# Altium schematic sheet altuamSTM32_schematic.SchDoc
size A3; DrawnBy: Mohamed Sayed; Engineer: Mohamed Sayed; SheetNumber: 1; SheetTotal: 1
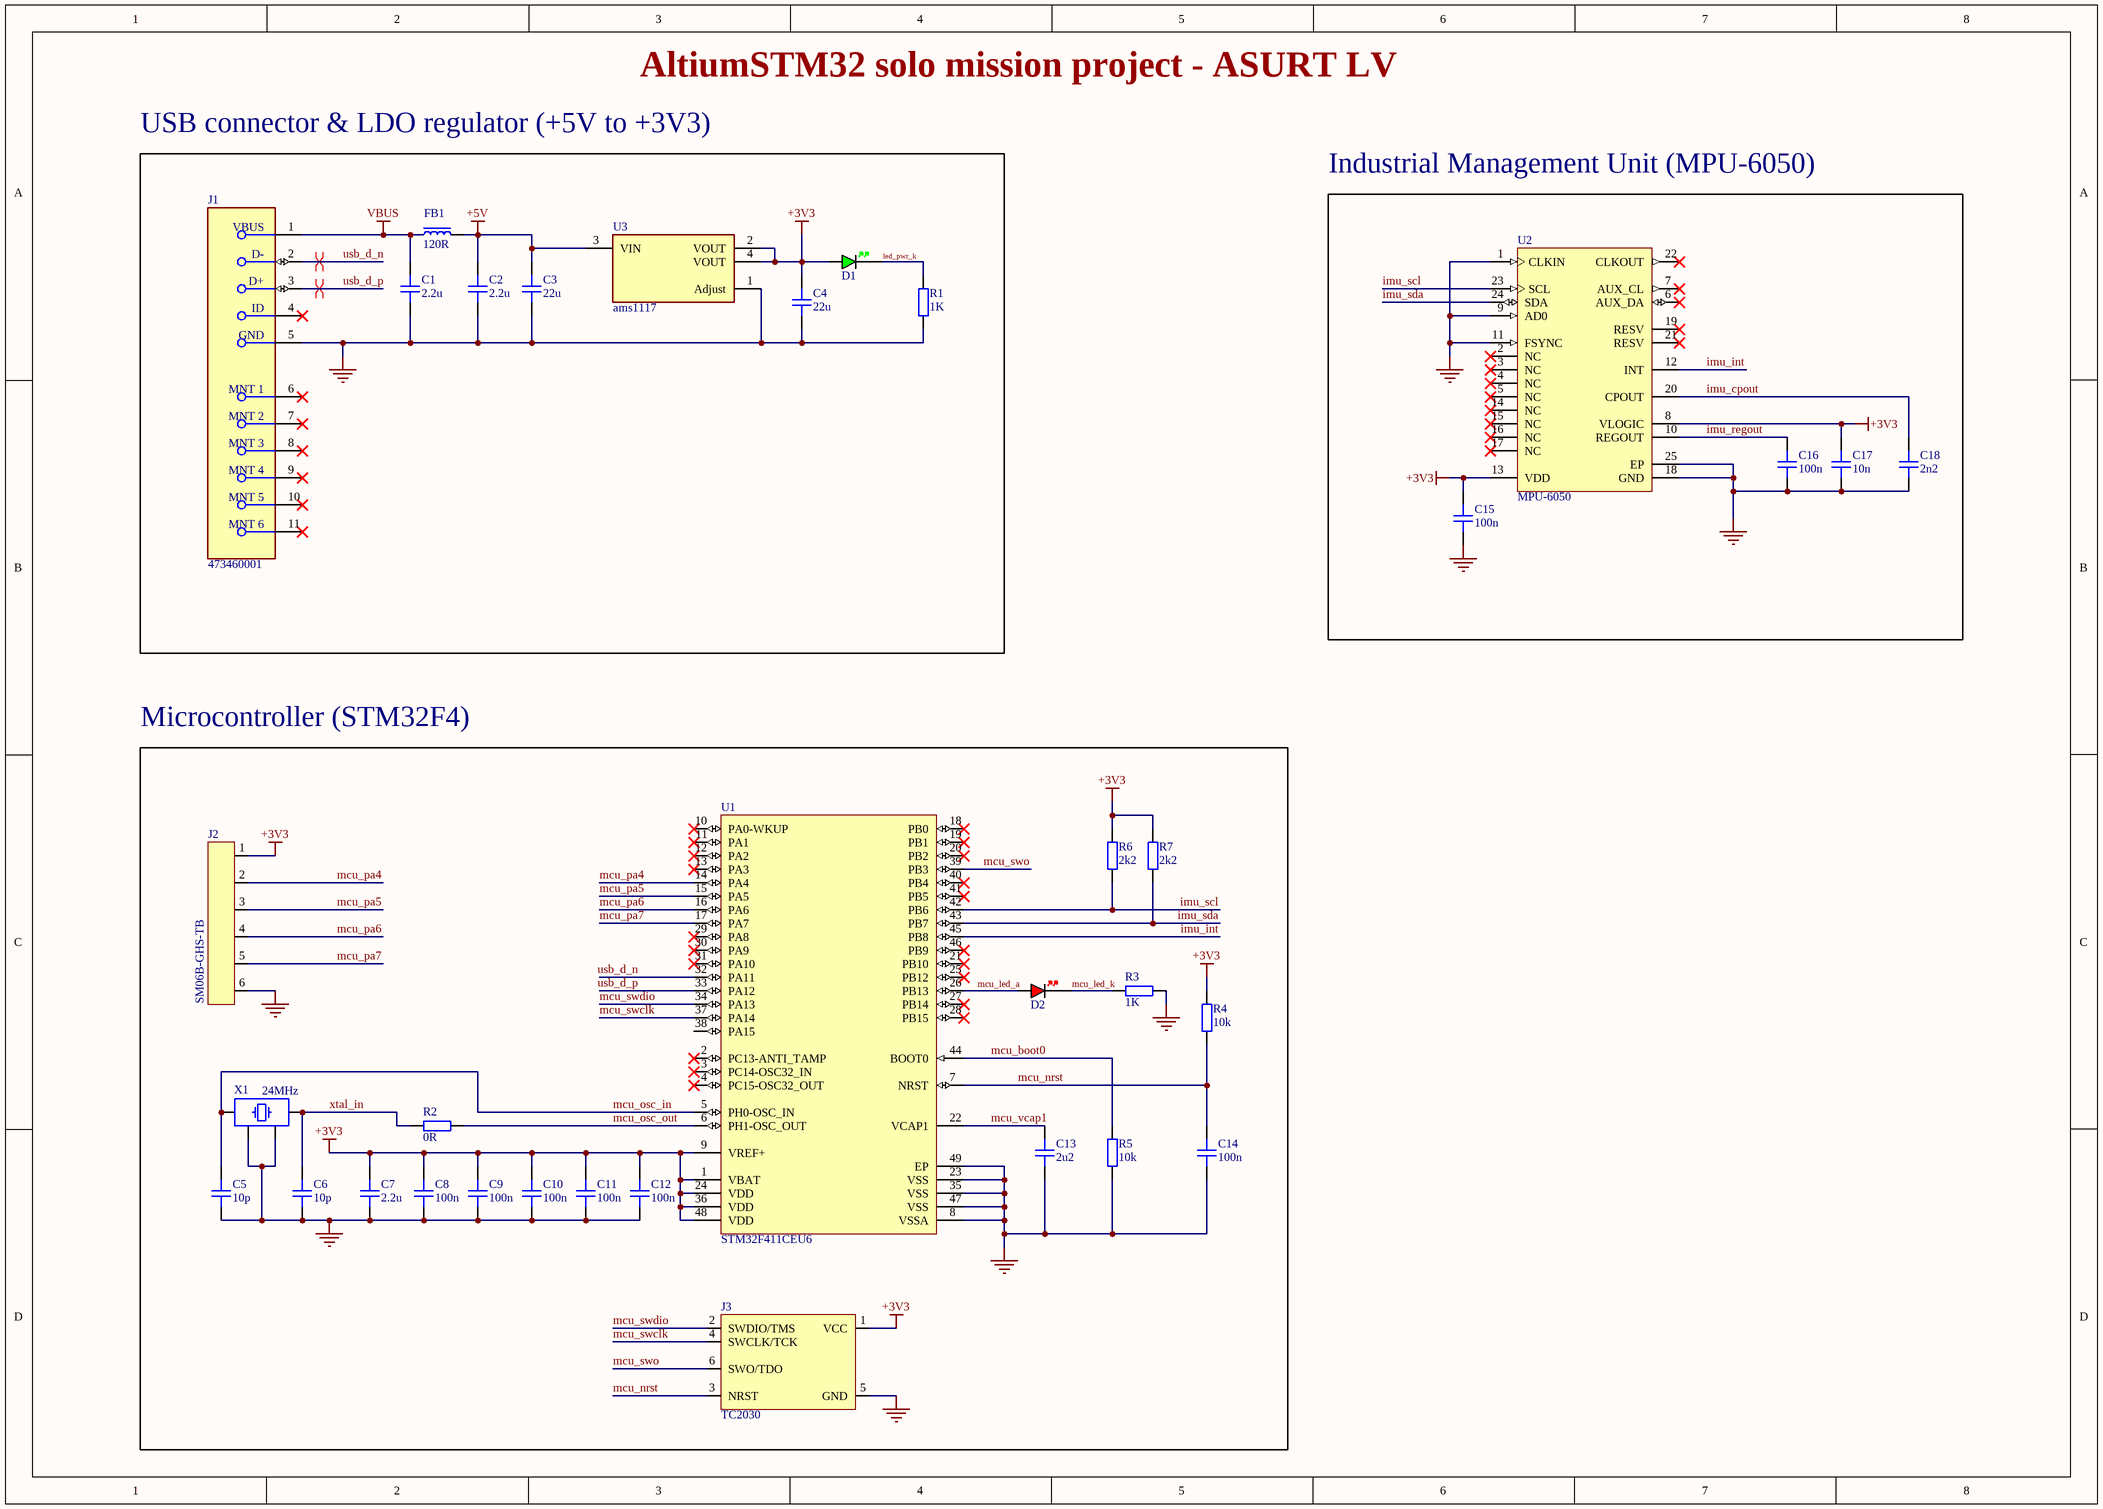
[diagram p0: altuamSTM32_schematic.SchDoc]

## Parts
C1  2.2u  [CAP_0603]
C2  2.2u  [CAP_0603]
C3  22u  [CAP_0805]
C4  22u  [CAP_0805]
C5  10p  [CAP_0402]
C6  10p  [CAP_0402]
C7  2.2u  [CAP_0603]
C8  100n  [CAP_0402]
C9  100n  [CAP_0402]
C10  100n  [CAP_0402]
C11  100n  [CAP_0402]
C12  100n  [CAP_0402]
C13  2u2  [CAP_0603]
C14  100n  [CAP_0402]
C15  100n  [CAP_0402]
C16  100n  [CAP_0402]
C17  10n  [CAP_0402]
C18  2n2  [CAP_0402]
D1  GREEN  [LED_0402_GREEN]  (value not drawn)
D2  RED  [LED_0402_RED]  (value not drawn)
FB1  120R  [FB_0603]
J1  473460001  [FP-473460001-MFG]
J2  SM06B-GHS-TB  [SM06B-GHS-TB]
J3  TC2030  [TC2030-FP]  (no BOM)
R1  1K  [RES_0402]
R2  0R  [RES_0402]
R3  1K  [RES_0402]
R4  10k  [RES_0402]
R5  10k  [RES_0402]
R6  2k2  [RES_0402]
R7  2k2  [RES_0402]
U1  STM32F411CEU6  [STM-UFQFPN48_L]
U2  MPU-6050  [IS-QFN-24_V]
U3  ams1117  [FP-ams1117-IPC_C]
X1  24MHz  [XTAL_3225]

## Blocks framed on the sheet
USB connector & LDO regulator (+5V to +3V3): C1-C4 D1 FB1 J1 R1 U3
Industrial Management Unit (MPU-6050): C15-C18 U2
Microcontroller (STM32F4): C5-C14 D2 J2 J3 R2-R7 U1 X1

## Nets
+3V3: C4.2 C7.2 C8.2 C9.2 C10.2 C11.2 C12.2 C15.2 C17.2 D1.A J2.1 J3.1(VCC) R4.2 R6.2 R7.2 U1.1(VBAT) U1.9(VREF+) U1.24(VDD) U1.36(VDD) U1.48(VDD) U2.8(VLOGIC) U2.13(VDD) U3.2(VOUT) U3.4(VOUT)
+5V: C2.2 C3.2 FB1.2 U3.3(VIN)
GND: C1.1 C2.1 C3.1 C4.1 C5.1 C6.1 C7.1 C8.1 C9.1 C10.1 C11.1 C12.1 C13.1 C14.1 C15.1 C16.1 C17.1 C18.1 J1.5(GND) J2.6 J3.5(GND) R1.1 R3.1 R5.1 U1.8(VSSA) U1.23(VSS) U1.35(VSS) U1.47(VSS) U1.49(EP) U2.1(CLKIN) U2.9(AD0) U2.11(FSYNC) U2.18(GND) U2.25(EP) U3.1(Adjust) X1.2 X1.4
VBUS: C1.2 FB1.1 J1.1(VBUS)
imu_cpout: C18.2 U2.20(CPOUT)
imu_int: U1.45(PB8) U2.12(INT)
imu_regout: C16.2 U2.10(REGOUT)
imu_scl: R6.1 U1.42(PB6) U2.23(SCL)
imu_sda: R7.1 U1.43(PB7) U2.24(SDA)
led_pwr_k: D1.K R1.2
mcu_boot0: R5.2 U1.44(BOOT0)
mcu_led_a: D2.A U1.26(PB13)
mcu_led_k: D2.K R3.2
mcu_nrst: C14.2 J3.3(NRST) R4.1 U1.7(NRST)
mcu_osc_in: C5.2 U1.5(PH0-OSC_IN) X1.1
mcu_osc_out: R2.2 U1.6(PH1-OSC_OUT)
mcu_pa4: J2.2 U1.14(PA4)
mcu_pa5: J2.3 U1.15(PA5)
mcu_pa6: J2.4 U1.16(PA6)
mcu_pa7: J2.5 U1.17(PA7)
mcu_swclk: J3.4(SWCLK/TCK) U1.37(PA14)
mcu_swdio: J3.2(SWDIO/TMS) U1.34(PA13)
mcu_swo: J3.6(SWO/TDO) U1.39(PB3)
mcu_vcap1: C13.2 U1.22(VCAP1)
usb_d_n: J1.2(D-) U1.32(PA11)
usb_d_p: J1.3(D+) U1.33(PA12)
xtal_in: C6.2 R2.1 X1.3

Not connected (* = marked no-connect by the designer): J1 4(ID)* 6(MNT_1)* 7(MNT_2)* 8(MNT_3)* 9(MNT_4)* 10(MNT_5)* 11(MNT_6)*; U1 2(PC13-ANTI_TAMP)* 3(PC14-OSC32_IN)* 4(PC15-OSC32_OUT)* 10(PA0-WKUP)* 11(PA1)* 12(PA2)* 13(PA3)* 18(PB0)* 19(PB1)* 20(PB2)* 21(PB10)* 25(PB12)* 27(PB14)* 28(PB15)* 29(PA8)* 30(PA9)* 31(PA10)* 38(PA15) 40(PB4)* 41(PB5)* 46(PB9)*; U2 2(NC)* 3(NC)* 4(NC)* 5(NC)* 6(AUX_DA)* 7(AUX_CL)* 14(NC)* 15(NC)* 16(NC)* 17(NC)* 19(RESV)* 21(RESV)* 22(CLKOUT)*

## Layout directives
differential pair: usb_d_n, usb_d_p

## Notes on the sheet
- AltiumSTM32 solo mission project - ASURT LV

## Library data of the parts
C1 C2 C7 C13 = CAP_0603: Capacitor SMD 0603; Manufacturer: *; Manufacturer Part Number: *; Distributor Link: *; LCSC: *; Rating: *; Dielectric: *
C3 C4 = CAP_0805: Capacitor SMD 0805; Manufacturer: *; Manufacturer Part Number: *; Distributor Link: *; LCSC: *; Rating: *; Dielectric: *
C5 C6 C8-C12 C14-C18 = CAP_0402: Capacitor SMD 0402; Manufacturer: *; Manufacturer Part Number: *; Distributor Link: *; LCSC: *; Rating: *; Dielectric: *
D1 = LED_0402_GREEN: LED 0402 GREEN SMD
D2 = LED_0402_RED: LED 0402 RED SMD
FB1 = FB_0603: Ferrite Bead SMD 0603; Manufacturer: *; Manufacturer Part Number: *; Distributor Link: *; LCSC: *
J1 = CMP-2000-05246-2: CONN RCPT USB2.0 MICRO B SMD R/A; Manufacturer: Molex; Conn Orientation: Right Angle; Is Female: yes; Shielding: true; Pitch: 0.65mm; Number Of Contacts: 5; Description: USB - micro B USB 2.0 Receptacle Connector 5 Position Surface Mount, Right Angle; Voltage Rating: 30V; Current Rating: 1.8A; Device Class L2: USB Connectors; Digikey Description: CONN RCPT USB2.0 MICRO B SMD R/A; Height: 2.945mm; RoHS: TRUE; ComponentLink2Description: Datasheet; Octopart: https://octopart.com/47346-0001-molex-7164928; Automotive: No; Package: 0; Category: Conn; Device Class L1: Connectors; Usb Standard: USB 2.0; Temperature: -30°C to +85°C; Temperature Range Low: -30°C; Footprint Url: https://www.molex.com/pdm_docs/sd/473460001_sd.pdf; ComponentLink2URL: https://www.molex.com/webdocs/datasheets/pdf/en-us/0473460001_IO_CONNECTORS.pdf; Lead Free: Yes; Manufacturer Part Number: 473460001; Contact Material: Gold,Nickel; Temperature Range High: +85°C; Device Class L3: unset
J2 = SM06B-GHS-TB: Header Connector 6 Position 1.25MM Pitch SMD Horizontal JST GH; Manufacturer: JST; Manufacturer Part Number: SM06B-GHS-TB
J3 = TC2030: Tag-Connect No-Solder SWD Debug Connector DO NOT PLACE; Manufacturer: Tag-Connect; Manufacturer Part Number: TC2030
R1-R7 = RES_0402: Resistor SMD 0402; Manufacturer: *; Manufacturer Part Number: *; Distributor Link: *; LCSC: *
U1 = CMP-0243-00165-1: ARM Cortex-M4 32-bit MCU+FPU, 512 KB Flash, 128 KB RAM, 36 I/Os, 48-Pin UFQFPN, -40 to 85 degC, Tray; Operating Frequency(F) (Processor speed) (MHz): 100; FLASH Size (Prog) (kB): 512; Internal RAM Size (kB): 128; I/Os (High Current): 36; Supply Voltage(Vcc) min (V): 1.7; Package Reference: 48-Pin Ultra Thin Fine Pitch Quad Flat No-Lead, 7 x 7 x 0.6 mm Body, 0.5 mm Pitch, Exposed Pad; ComponentLink1Description: Manufacturer URL; ComponentLink1URL: http://www.st.com/; Packing: Tray; Package Description: UFQFPN48; Core: ARM Cortex-M4; ComponentLink2Description: Datasheet; ComponentLink2URL: http://www.st.com/st-web-ui/static/active/en/resource/technical/document/datasheet/DM00115249.pdf; DatasheetVersion: Rev. 6; Mounting Technology: Surface Mount
U2 = CMP-1753-00002-2: 3-Axis Gyroscope, Accelerometer and a Digital Motion Processor(TM) (DMP), 2.375 to 3.46 V, -40 to 85 degC, 24-Pin QFN, RoHS, Tape and Reel; Manufacturer: InvenSense; Featured Product: MPU-60506-Axis,IntegratedI²CSolution; Other Names: 1428-1007-2 / MPU6050; Sensor Type: MotionTracking; Online Catalog: MPU-6000™Series; Unit PriceUSD: Digital; Datasheet Version: Rev. 3.3, 05/2012; Category: Sensors,Transducers; Datasheet URL: http://datasheet.octopart.com/MPU-6050-InvenSense-datasheet-14421344.pdf; Family: Multifunction; Standard Package: 5,000; Manufacturer URL: http://www.invensense.com/; Output Type: Digital; Dynamic Catalog: MPU-6000™Series
U3 = CMP-209535-000002-1: 1A LOW DROPOUT VOLTAGE REGULATOR; RoHS Compliant: Yes
X1 = TSX-3225_24.0000MF15X-AC: Crystal SMD 24MHz 10PPM 7pF 3225; Manufacturer: Epson; Manufacturer Part Number: TSX-3225 24.0000MF15X-AC